# EAGLE design App__JehanSagadevan (EAGLE 5.11)
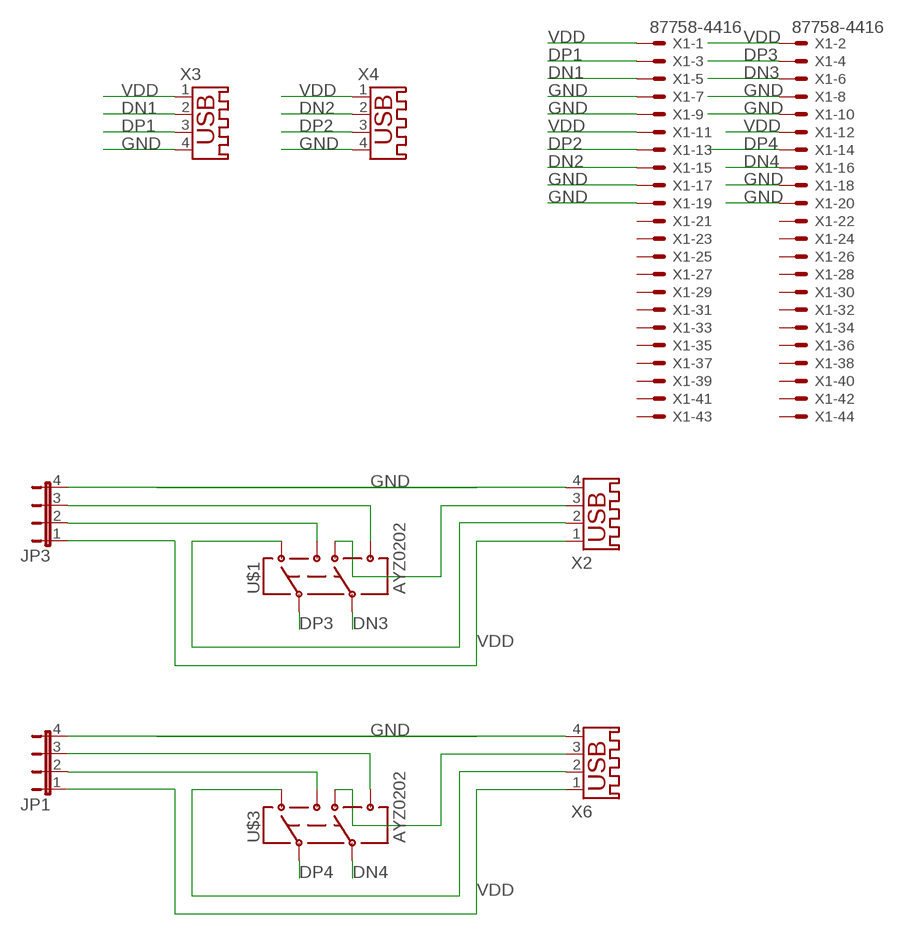
[diagram p0: schematic, sheet 1]

## Parts
JP1  JP4E  [JP4]
JP3  JP4E  [JP4]
U$1  AYZ0202  [AYZ0202]
U$3  AYZ0202  [AYZ0202]
X1  87758-4416  [87758-4416]
X2  USB-A003  [USB-A003]
X3  USB-A003  [USB-A003]
X4  USB-A003  [USB-A003]
X6  USB-A003  [USB-A003]

## Nets
DN1: X1.5 X3.2
DN2: X1.15 X4.2
DN3: X1.6
DN4: X1.16
DP1: X1.3 X3.3
DP2: X1.13 X4.3
DP3: U$1.2 X1.4
DP4: U$3.2 X1.14
GND: JP1.4 JP3.4 X1.7 X1.8 X1.9 X1.10 X1.17 X1.18 X1.19 X1.20 X2.4 X3.4 X4.4 X6.4
N$1: JP3.2 U$1.1
N$2: U$1.3 X2.2
N$3: JP3.3 U$1.4
N$6: JP1.3 U$3.4
N$13: U$1.6 X2.3
N$21: JP1.2 U$3.1
N$22: U$3.3 X6.2
N$24: U$3.6 X6.3
VDD: JP1.1 JP3.1 X1.1 X1.2 X1.11 X1.12 X2.1 X3.1 X4.1 X6.1
Unconnected: U$1.5 U$3.5 X1.21 X1.22 X1.23 X1.24 X1.25 X1.26 X1.27 X1.28 X1.29 X1.30 X1.31 X1.32 X1.33 X1.34 X1.35 X1.36 X1.37 X1.38 X1.39 X1.40 X1.41 X1.42 X1.43 X1.44

## Library data of the parts
JP1 JP3 = jumper:JP4E: JUMPER
U$1 U$3 = SparkFun:AYZ0202: SPDT Slide Switch Simple SMD single-pull double-throw slide switch. Good for less than 350mA power switch, switching UARTs between devices, etc. Spark Fun Electronics SKU : COM-00597
X1 = con-molex:87758-4416: 44 Pin - 2mm Dual Row Single Wafer, Vertical T/H HDR Source: http://www.molex.com/pdm_docs/sd/877580616_sd.pdf; MF: MOLEX; MPN: 87758-4416; OC_FARNELL: unknown; OC_NEWARK: 59J1588
X2-X4 X6 = con-yamaichi:USB-A003: USB connector; OC_FARNELL: unknown; OC_NEWARK: unknown

## Board
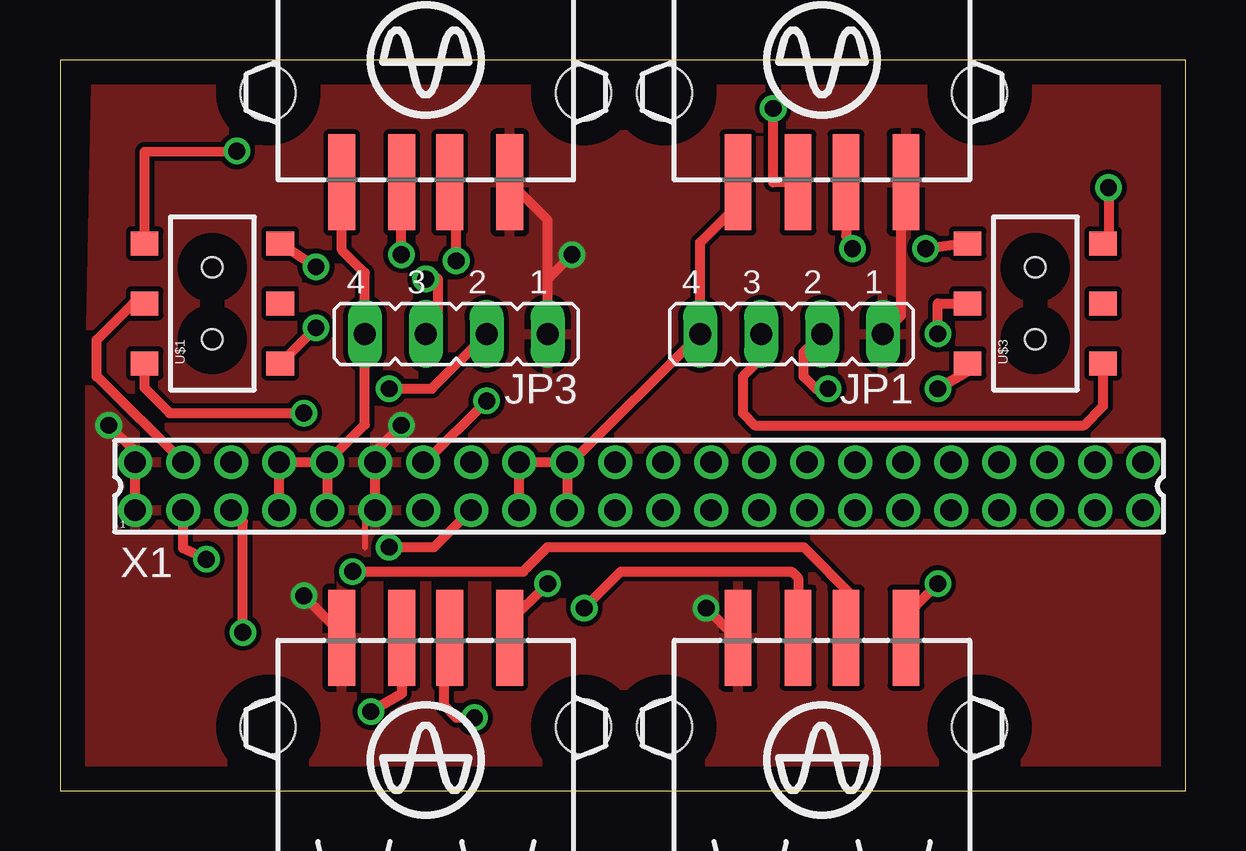
[diagram p1: board, top side]
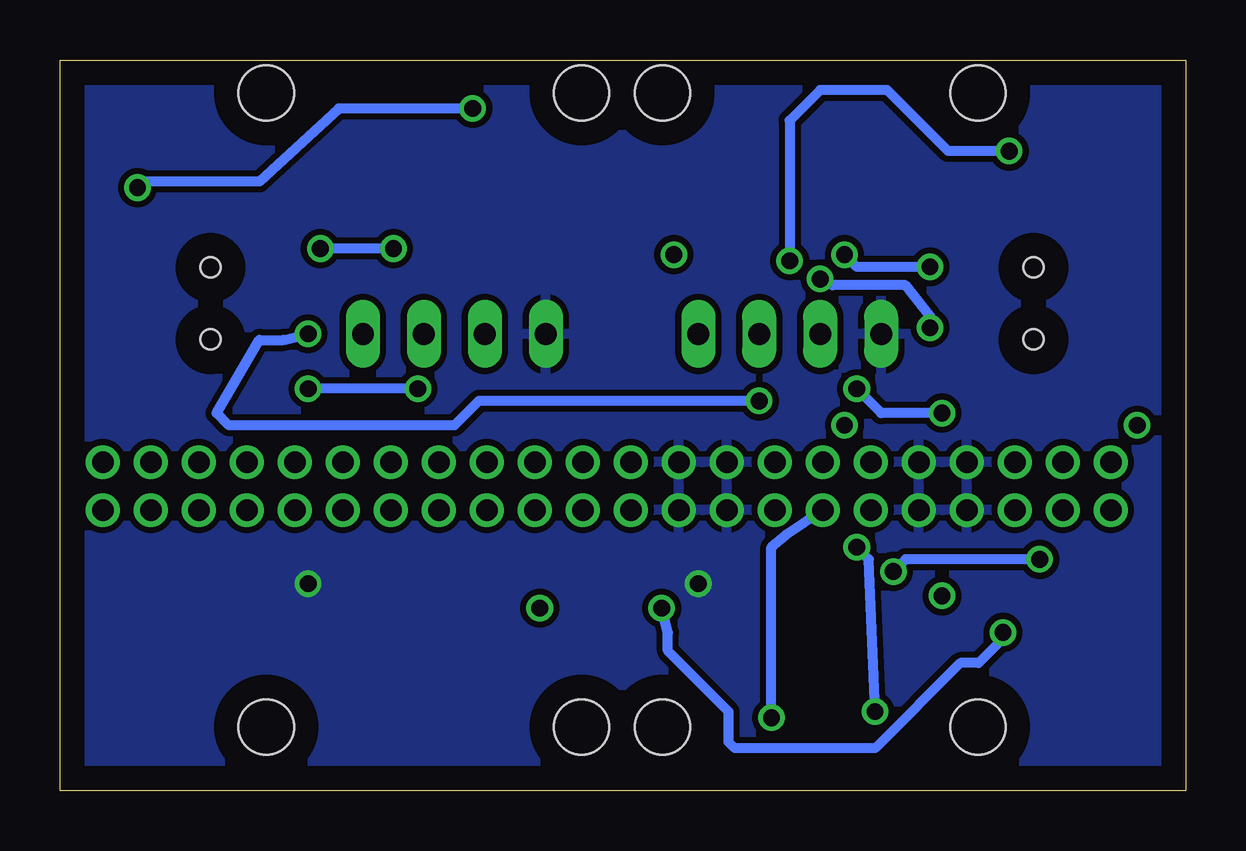
[diagram p2: board, bottom side, seen from below]

Size 46.91 x 30.47 mm. Coordinates in mm from the lower left corner, seen from the top.
Outline: 0,0 46.91,0 46.91,30.47 0,30.47 0,0
Copper layers (1*16): Top 0.035mm / dielectric 1.5mm / Bottom 0.035mm
Design rules "default": minimum track width 10mil, minimum drill 24mil, track to track 8mil, track to pad 8mil, pad to pad 8mil, via to via 8mil, smd to smd 8mil, copper to edge 40mil, drill to drill 8mil, minimum pad ring 10mil, minimum via ring 8mil, stop-mask expansion 4mil, vias tented up to drill 0mil, thermal gap 10mil

### Footprints (pad centres in the part's own frame; a part is rotated, then mirrored left to right if it is on the bottom)
JP4 = drill 0.914 long: 1 -3.81,0; 2 -1.27,0; 3 1.27,0; 4 3.81,0
AYZ0202 = smd 1 x 1.15: 1 -2.5,2.825; 2 0,2.825; 3 2.5,2.825; 4 -2.5,-2.825; 5 0,-2.825; 6 2.5,-2.825 | hole 0.85: 1.5,0; -1.5,0
87758-4416 = drill 0.9 pad 1.27 round: 1 -21,-1; 2 -21,1; 3 -19,-1; 4 -19,1; 5 -17,-1; 6 -17,1; 7 -15,-1; 8 -15,1; 9 -13,-1; 10 -13,1; 11 -11,-1; 12 -11,1; 13 -9,-1; 14 -9,1; 15 -7,-1; 16 -7,1; 17 -5,-1; 18 -5,1; 19 -3,-1; 20 -3,1; 21 -1,-1; 22 -1,1; 23 1,-1; 24 1,1; 25 3,-1; 26 3,1; 27 5,-1; 28 5,1; 29 7,-1; 30 7,1; 31 9,-1; 32 9,1; 33 11,-1; 34 11,1; 35 13,-1; 36 13,1; 37 15,-1; 38 15,1; 39 17,-1; 40 17,1; 41 19,-1; 42 19,1; 43 21,-1; 44 21,1
USB-A003 = smd 1.12 x 4: 1 -3.5,14; 2 -1,14; 3 1,14; 4 3.5,14 | hole 2.3: -6.57,10.28; 6.57,10.28

### Placement (x,y rotation side)
JP1  30.48,19.05 180 top
JP3  16.51,19.05 180 top
U$1  6.35,20.32 90 top
U$3  40.64,20.32 90 top
X1  24.13,12.7 0 top
X2  15.24,39.37 180 top
X3  31.75,-7.62 0 top
X4  15.24,-7.62 0 top
X6  31.75,39.37 180 top

### Tracks (layer width: path | path; a pad name or v marks a point on that pad's centre or on a via)
DN1  (via drill 0.7)
  Top 0.406: X3.2 30.75,8.87 30.48,9.14 23.37,9.14 v21.84,7.62 | v7.62,6.6 7.62,11.21 X1.5
  Bottom 0.406: v21.84,7.62 21.59,6.6 21.59,5.84 19.05,3.3 19.05,2.03 18.8,1.78 12.95,1.78 9.4,5.33 8.64,5.33 7.62,6.35 v7.62,6.6
DN2  (via drill 0.7)
  Top 0.406: X4.2 14.24,4.05 v12.95,3.3 | v13.72,10.16 15.59,10.16 X1.15
  Bottom 0.406: v12.95,3.3 13.21,9.65 v13.72,10.16
DP1  (via drill 0.7)
  Top 0.406: X1.3 5.13,10.11 v6.1,9.65 | v12.19,9.14 19.3,9.14 20.32,10.16 30.99,10.16 33.02,8.13 33.02,6.65 X3.3
  Bottom 0.406: v6.1,9.65 11.68,9.65 v12.19,9.14
DP2  (via drill 0.7)
  Top 0.406: 15.99,6.33 X4.3 16,6.14 16,3.56 16.51,3.05 v17.27,3.05
  Bottom 0.406: v17.27,3.05 17.27,10.16 16.67,10.67 X1.13
DP3
  Top 0.406: U$1.2 3.05,20.32 1.52,18.8 1.52,17.27 1.56,17.27 X1.4
DP4  (via drill 0.7)
  Top 0.406: X1.14 15.22,13.7 v17.78,16.26 | v36.58,19.05 36.58,20.32 U$3.2
  Bottom 0.406: v17.78,16.26 29.46,16.26 30.48,15.24 39.88,15.24 40.39,15.75 38.61,18.8 37.59,18.8 v36.58,19.05
GND  (via drill 0.7)
  Top 0.406: X1.10 X1.8 X1.7 | X2.4 11.74,22.55 12.7,21.59 JP3.4 12.7,15.27 X1.10 | X6.4 28.25,24.44 26.67,22.86 JP1.4 21.32,13.7 X1.20 | X4.4 18.74,7.06 v20.32,8.64 | X1.10 X1.9 | X1.17 X1.18 X1.20 | X1.20 X1.19 | X3.4 35.25,7.31 v36.58,8.64
  pour Bottom (isolate 0.254): 1.02,29.97 46.23,29.97 46.23,0.51 1.02,0.51 1.02,28.96
N$1  (via drill 0.7)
  Top 0.406: U$1.1 3.52,16.8 4.57,15.75 v10.16,15.75 | v13.72,16.76 15.49,16.76 JP3.2
  Bottom 0.406: v10.16,15.75 12.7,15.75 v13.72,16.76
N$2  (via drill 0.7)
  Top 0.406: U$1.3 3.52,26.64 v7.37,26.67 | v16.51,22.1 16.51,25.1 X2.2
  Bottom 0.406: v16.51,22.1 16.51,27.94 15.24,29.21 12.45,29.21 9.91,26.67 v7.37,26.67
N$3  (via drill 0.7)
  Top 0.406: U$1.4 v10.67,19.3 | v15.24,21.34 15.75,21.34 15.75,19.56 JP3.3
  Bottom 0.406: v10.67,19.3 10.67,19.81 11.68,21.08 14.73,21.08 v15.24,21.34
N$6
  Top 0.406: JP1.3 29.21,18.03 28.45,17.27 28.45,15.75 28.96,15.24 42.67,15.24 43.47,16.03 U$3.4
N$13  (via drill 0.7)
  Top 0.406: U$1.6 v10.67,21.84 | v14.22,22.35 14.22,25.35 X2.3
  Bottom 0.406: v10.67,21.84 13.72,21.84 v14.22,22.35
N$21  (via drill 0.7)
  Top 0.406: U$3.1 37.81,17.5 v36.58,16.76 | v32,16.76 31.5,16.76 30.99,17.27 30.99,18.29 JP1.2
  Bottom 0.406: v32,16.76 v36.58,16.76
N$22  (via drill 0.7)
  Top 0.406: X6.2 32.75,23.13 v33.02,22.61 | v36.07,22.61 37.77,22.86 U$3.3
  Bottom 0.406: v33.02,22.61 v36.07,22.61
N$24  (via drill 0.7)
  Top 0.406: X6.3 29.72,25.37 v29.72,28.45 | v43.69,25.15 43.69,23.04 U$3.6
  Bottom 0.406: v29.72,28.45 35.31,28.45 38.61,25.4 43.43,25.4 v43.69,25.15
VDD  (via drill 0.7)
  Top 0.254: 12.7,10.16 12.7,11.43 X1.11
  Top 0.406: X1.1 X1.2 3.13,14.14 v2.03,15.24 | X2.1 20.32,23.79 JP3.1 20.32,21.34 v21.34,22.35 | X6.1 35.25,24.58 35.05,24.38 35.05,19.81 JP1.1 | v14.22,15.24 13.13,14.15 X1.12 X1.11 13.19,11.7 13.21,11.68 | X4.1 11.74,6.55 v10.16,8.13 | X3.1 28.16,6.38 v26.92,7.62
  pour Top: 1.52,30.48 46.74,30.48 46.74,0 1.02,0 1.02,5.08